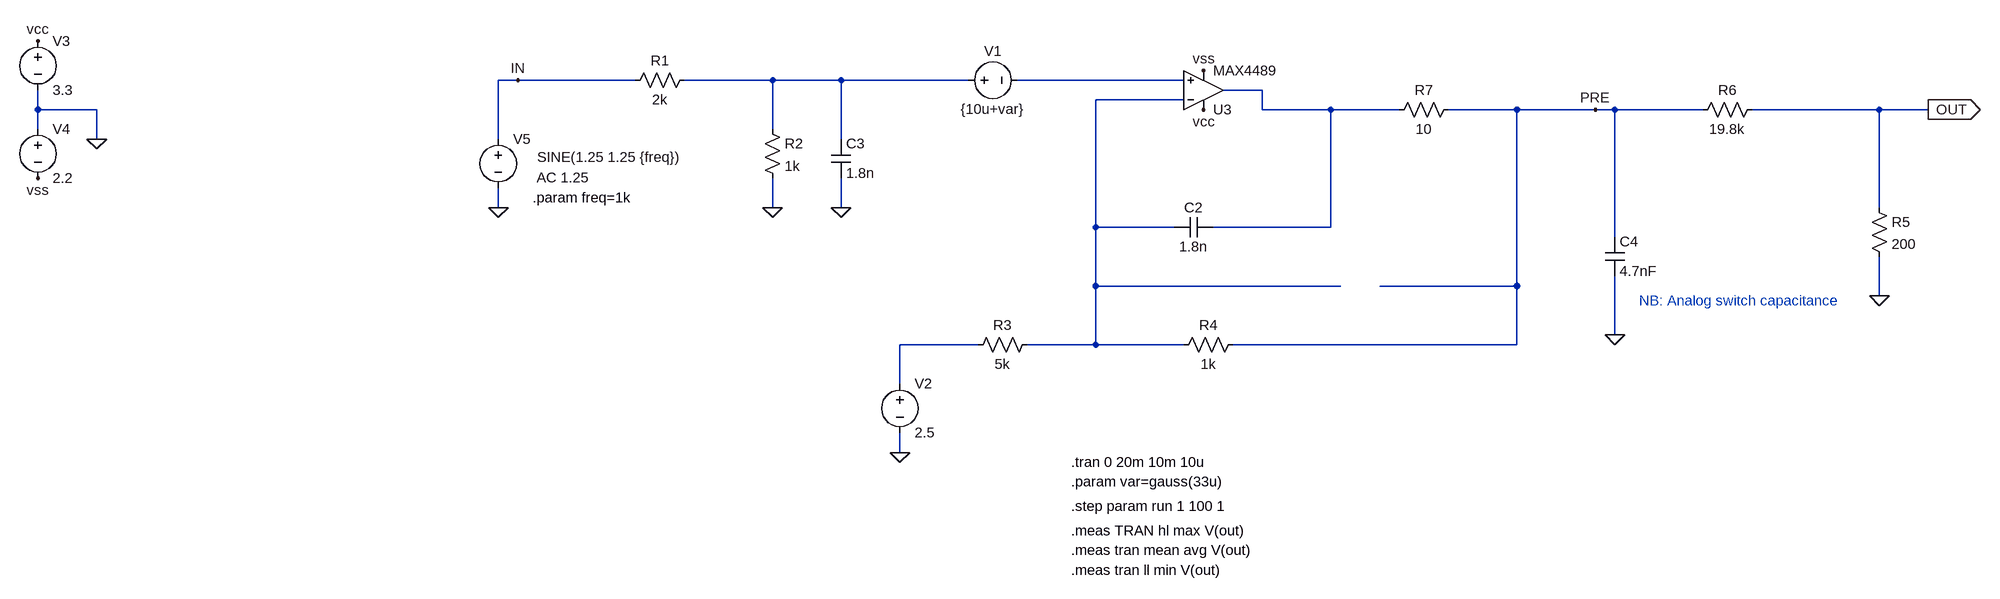
[diagram p0: schematic max4489_unipolar-to-bipolar_offset.asc]
max4489_unipolar-to-bipolar_offset.asc, the LTspice schematic file:
Version 4.1
SHEET 1 2300 1252
WIRE -416 128 -448 128
WIRE -224 128 -416 128
WIRE 0 128 -144 128
WIRE 112 128 0 128
WIRE 320 128 112 128
WIRE 672 128 400 128
WIRE 800 144 736 144
WIRE 672 160 528 160
WIRE -1200 176 -1200 144
WIRE -1104 176 -1200 176
WIRE 800 176 800 144
WIRE 912 176 800 176
WIRE 1024 176 912 176
WIRE 1216 176 1104 176
WIRE 1344 176 1216 176
WIRE 1376 176 1344 176
WIRE 1520 176 1376 176
WIRE 1808 176 1600 176
WIRE 1888 176 1808 176
WIRE -1200 208 -1200 176
WIRE 0 208 0 128
WIRE -1104 224 -1104 176
WIRE -448 224 -448 128
WIRE 112 224 112 128
WIRE -448 336 -448 304
WIRE 0 336 0 288
WIRE 112 336 112 288
WIRE 1808 336 1808 176
WIRE 528 368 528 160
WIRE 656 368 528 368
WIRE 912 368 912 176
WIRE 912 368 720 368
WIRE 1376 384 1376 176
WIRE 528 464 528 368
WIRE 928 464 528 464
WIRE 1216 464 1216 176
WIRE 1216 464 992 464
WIRE 1808 480 1808 416
WIRE 1376 544 1376 448
WIRE 336 560 208 560
WIRE 528 560 528 464
WIRE 528 560 416 560
WIRE 672 560 528 560
WIRE 1216 560 1216 464
WIRE 1216 560 752 560
WIRE 208 624 208 560
WIRE 208 736 208 704
FLAG 208 736 0
FLAG -1104 224 0
FLAG -1200 288 vss
FLAG -1200 64 vcc
FLAG 0 336 0
FLAG -448 336 0
FLAG -416 128 IN
FLAG 704 112 vss
FLAG 704 176 vcc
FLAG 1344 176 PRE
FLAG 1808 480 0
FLAG 1888 176 OUT
IOPIN 1888 176 Out
FLAG 112 336 0
FLAG 1376 544 0
SYMBOL voltage 208 608 R0
WINDOW 123 0 0 Left 0
WINDOW 39 0 0 Left 0
SYMATTR InstName V2
SYMATTR Value 2.5
SYMBOL res 768 544 R90
WINDOW 0 0 56 VBottom 2
WINDOW 3 32 56 VTop 2
SYMATTR InstName R4
SYMATTR Value 1k
SYMBOL voltage -1200 48 R0
WINDOW 123 0 0 Left 0
WINDOW 39 0 0 Left 0
SYMATTR InstName V3
SYMATTR Value 3.3
SYMBOL voltage -1200 192 R0
WINDOW 123 0 0 Left 0
WINDOW 39 0 0 Left 0
SYMATTR InstName V4
SYMATTR Value 2.2
SYMBOL res 320 576 R270
WINDOW 0 32 56 VTop 2
WINDOW 3 0 56 VBottom 2
SYMATTR InstName R3
SYMATTR Value 5k
SYMBOL res -240 144 R270
WINDOW 0 32 56 VTop 2
WINDOW 3 0 56 VBottom 2
SYMATTR InstName R1
SYMATTR Value 2k
SYMBOL res -16 192 R0
SYMATTR InstName R2
SYMATTR Value 1k
SYMBOL voltage -448 208 R0
WINDOW 123 63 79 Left 2
WINDOW 39 0 0 Left 0
WINDOW 3 64 46 Left 2
SYMATTR Value2 AC 1.25
SYMATTR Value SINE(1.25 1.25 {freq})
SYMATTR InstName V5
SYMBOL res 1120 160 R90
WINDOW 0 0 56 VBottom 2
WINDOW 3 32 56 VTop 2
SYMATTR InstName R7
SYMATTR Value 10
SYMBOL cap 720 352 R90
WINDOW 0 0 32 VBottom 2
WINDOW 3 32 32 VTop 2
SYMATTR InstName C2
SYMATTR Value 1.8n
SYMBOL OpAmps\\MAX4489 704 208 M180
SYMATTR InstName U3
SYMBOL res 1792 320 R0
SYMATTR InstName R5
SYMATTR Value 200
SYMBOL res 1616 160 R90
WINDOW 0 0 56 VBottom 2
WINDOW 3 32 56 VTop 2
SYMATTR InstName R6
SYMATTR Value 19.8k
SYMBOL cap 96 224 R0
SYMATTR InstName C3
SYMATTR Value 1.8n
SYMBOL voltage 304 128 R270
WINDOW 0 32 56 VTop 2
WINDOW 3 -32 56 VBottom 2
WINDOW 123 0 0 Left 0
WINDOW 39 0 0 Left 0
SYMATTR InstName V1
SYMATTR Value {10u+var}
SYMBOL cap 1360 384 R0
SYMATTR InstName C4
SYMATTR Value 4.7nF
TEXT -392 320 Left 2 !.param freq=1k
TEXT 488 752 Left 2 !.tran 0 20m 10m 10u
TEXT 488 784 Left 2 !.param var=gauss(33u)
TEXT 488 824 Left 2 !.step param run 1 100 1
TEXT 488 864 Left 2 !.meas TRAN hl max V(out)
TEXT 488 896 Left 2 !.meas tran mean avg V(out)
TEXT 488 928 Left 2 !.meas tran ll min V(out)
TEXT 1416 488 Left 2 ;NB: Analog switch capacitance

The netlist it stands for:
* max4489_unipolar-to-bipolar_offset.asc
V2 N005 0 2.5
R4 PRE N004 1k
V3 vcc 0 3.3
V4 0 vss 2.2
R3 N005 N004 5k
R1 IN N001 2k
R2 N001 0 1k
V5 IN 0 SINE(1.25 1.25 {freq}) AC 1.25
R7 PRE N003 10
C2 N003 N004 1.8n
X§U3 N002 N004 vcc vss N003 MAX4489  ; pins In+ In- V+ V- OUT
R5 OUT 0 200
R6 OUT PRE 19.8k
C3 N001 0 1.8n
V1 N001 N002 {10u+var}
C4 PRE 0 4.7nF
.param freq=1k
.tran 0 20m 10m 10u
.param var=gauss(33u)
.step param run 1 100 1
.meas TRAN hl max V(out)
.meas tran mean avg V(out)
.meas tran ll min V(out)
* NB: Analog switch capacitance
.backanno
.end